# EasyEDA Pro project Simple Regulated Bench Power Supply.eprj

# Schematic Schematic1
Board Name: Board1; Create Date: 2026-09-13; Page Name: P1; Project Name: Simple Regulated Bench Power Supply; Schematic Name: Schematic1; Update Date: 2026-09-13; Company: EasyEDA.com; Page Size: A4; Version: V1.0
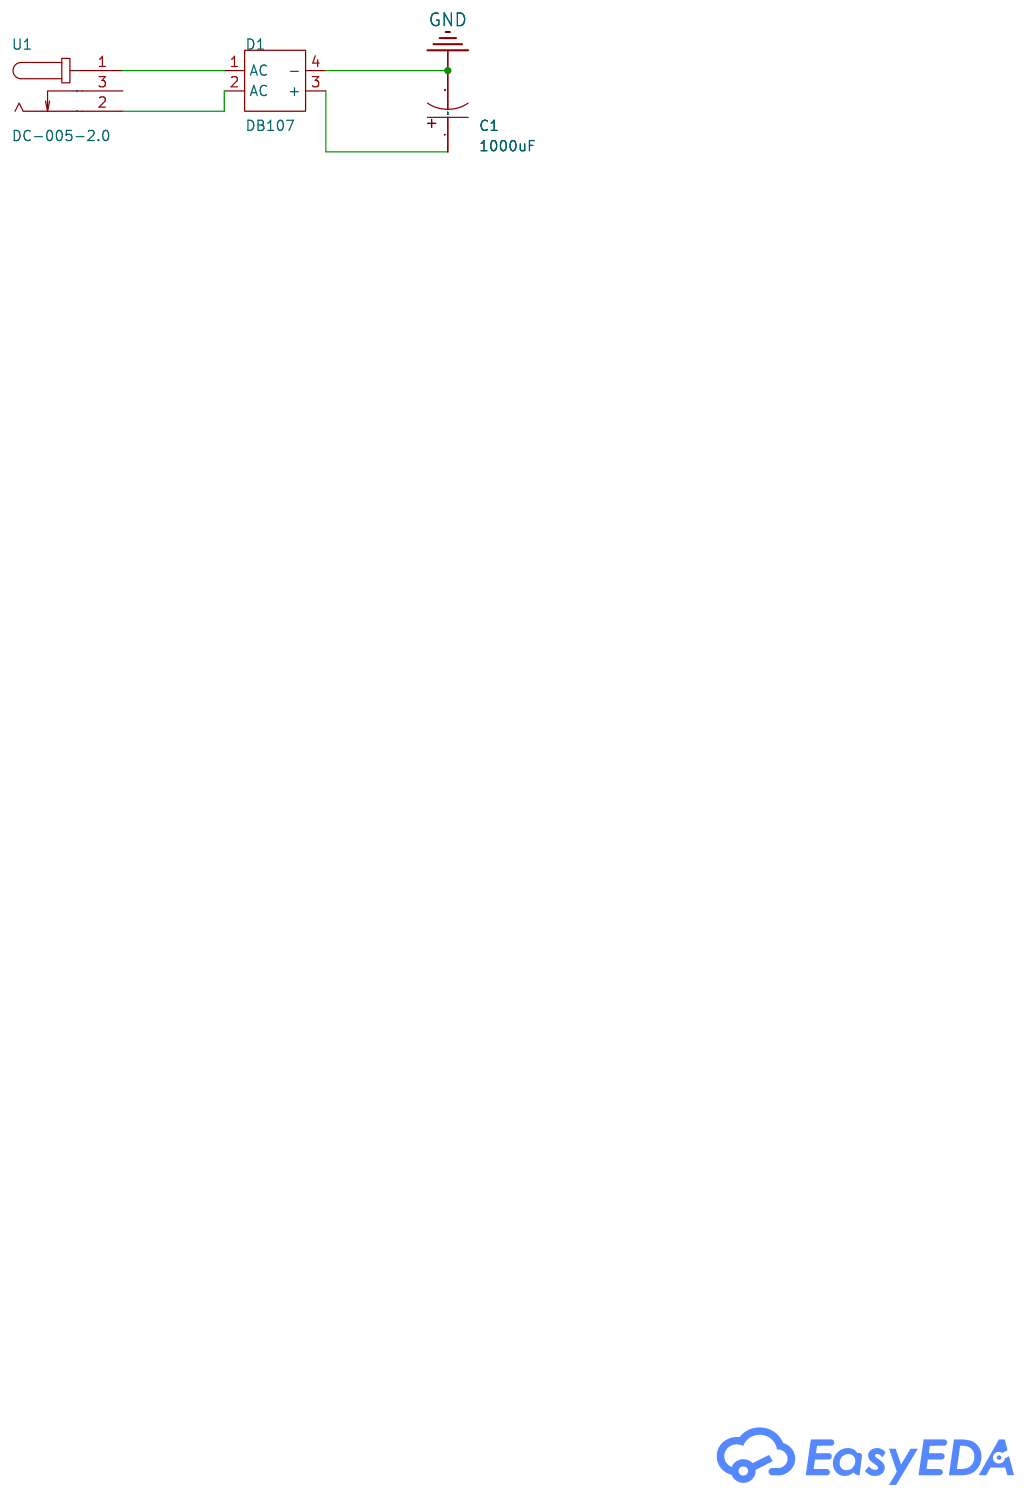
[diagram p0: schematic sheet]

## Parts
C1  1000uF  [CAP-TH_BD10.0-P5.00-D1.0-FD]
D1  DB107  [DIO-BG-TH_DB107]
U1  DC-005-2.0  [DC-IN-TH_DC-005-2.0_C22459640]

## Library data of the parts
C1 = ERR1VM102G20OT: LCSC Part Name: 1000uF ±20% 35V; Supplier Part: C398835; Manufacturer: AISHI(艾华集团); Supplier Footprint: 插件,D10xL20mm; JLCPCB Part Class: Extended Part; Datasheet: https://item.szlcsc.com/datasheet/ERR1VM102G20OT/381299.html; Supplier: LCSC; Tolerance: ±20%; Voltage Rating: 35V; Pin Spacing: 5mm; Diameter: 10mm; Height - Seated (Max): 20mm; Lifetime: 2000hrs@105℃
D1 = DB107_C52750554: LCSC Part Name: 耐压1000V；电流1A; Supplier Part: C52750554; Manufacturer: TOS(熙隆半导体); Supplier Footprint: DBM; JLCPCB Part Class: Extended Part; Datasheet: https://item.szlcsc.com/datasheet/DB107/55647463.html; Supplier: LCSC; Voltage - Forward(Vf@If): 1V@0.5A; Voltage - DC Reverse(Vr): 1kV; Current - Rectified: 1A; Reverse Leakage Current (Ir): 5uA@1000V; Non-Repetitive Peak Forward Surge Current: 80A; Operating Junction Temperature Range: -55℃~+150℃; Type: Single-Phase Rectifier
U1 = DC-005-2.0_C22459640: LCSC Part Name: DC电源插座 内径:2mm 外径:6.3mm; Supplier Part: C22459640; Manufacturer: HanElectricity(瀚源); Supplier Footprint: 插件; JLCPCB Part Class: Extended Part; Datasheet: https://item.szlcsc.com/datasheet/DC-005-2.0/24136246.html; Supplier: LCSC; Connector Type: DC Power Jack; Mounting Type: Right Angle; Inside Contact Diameter: 2mm; Outside Contact Diameter: 6.3mm; Current Rating: 3A; Voltage Rating (Max): 20V; Body Height: 11mm; Length: 13.9mm; Width: 9mm

## Nets
GND: C1.2 D1.4(-)
Net-(C1-1): C1.1 D1.3(+)
Net-(D1-1): D1.1(AC) U1.1
Net-(D1-2): D1.2(AC) U1.2

Not connected (* = marked no-connect by the designer): U1 3
